# Altium project smartknob_v2.PrjPcb
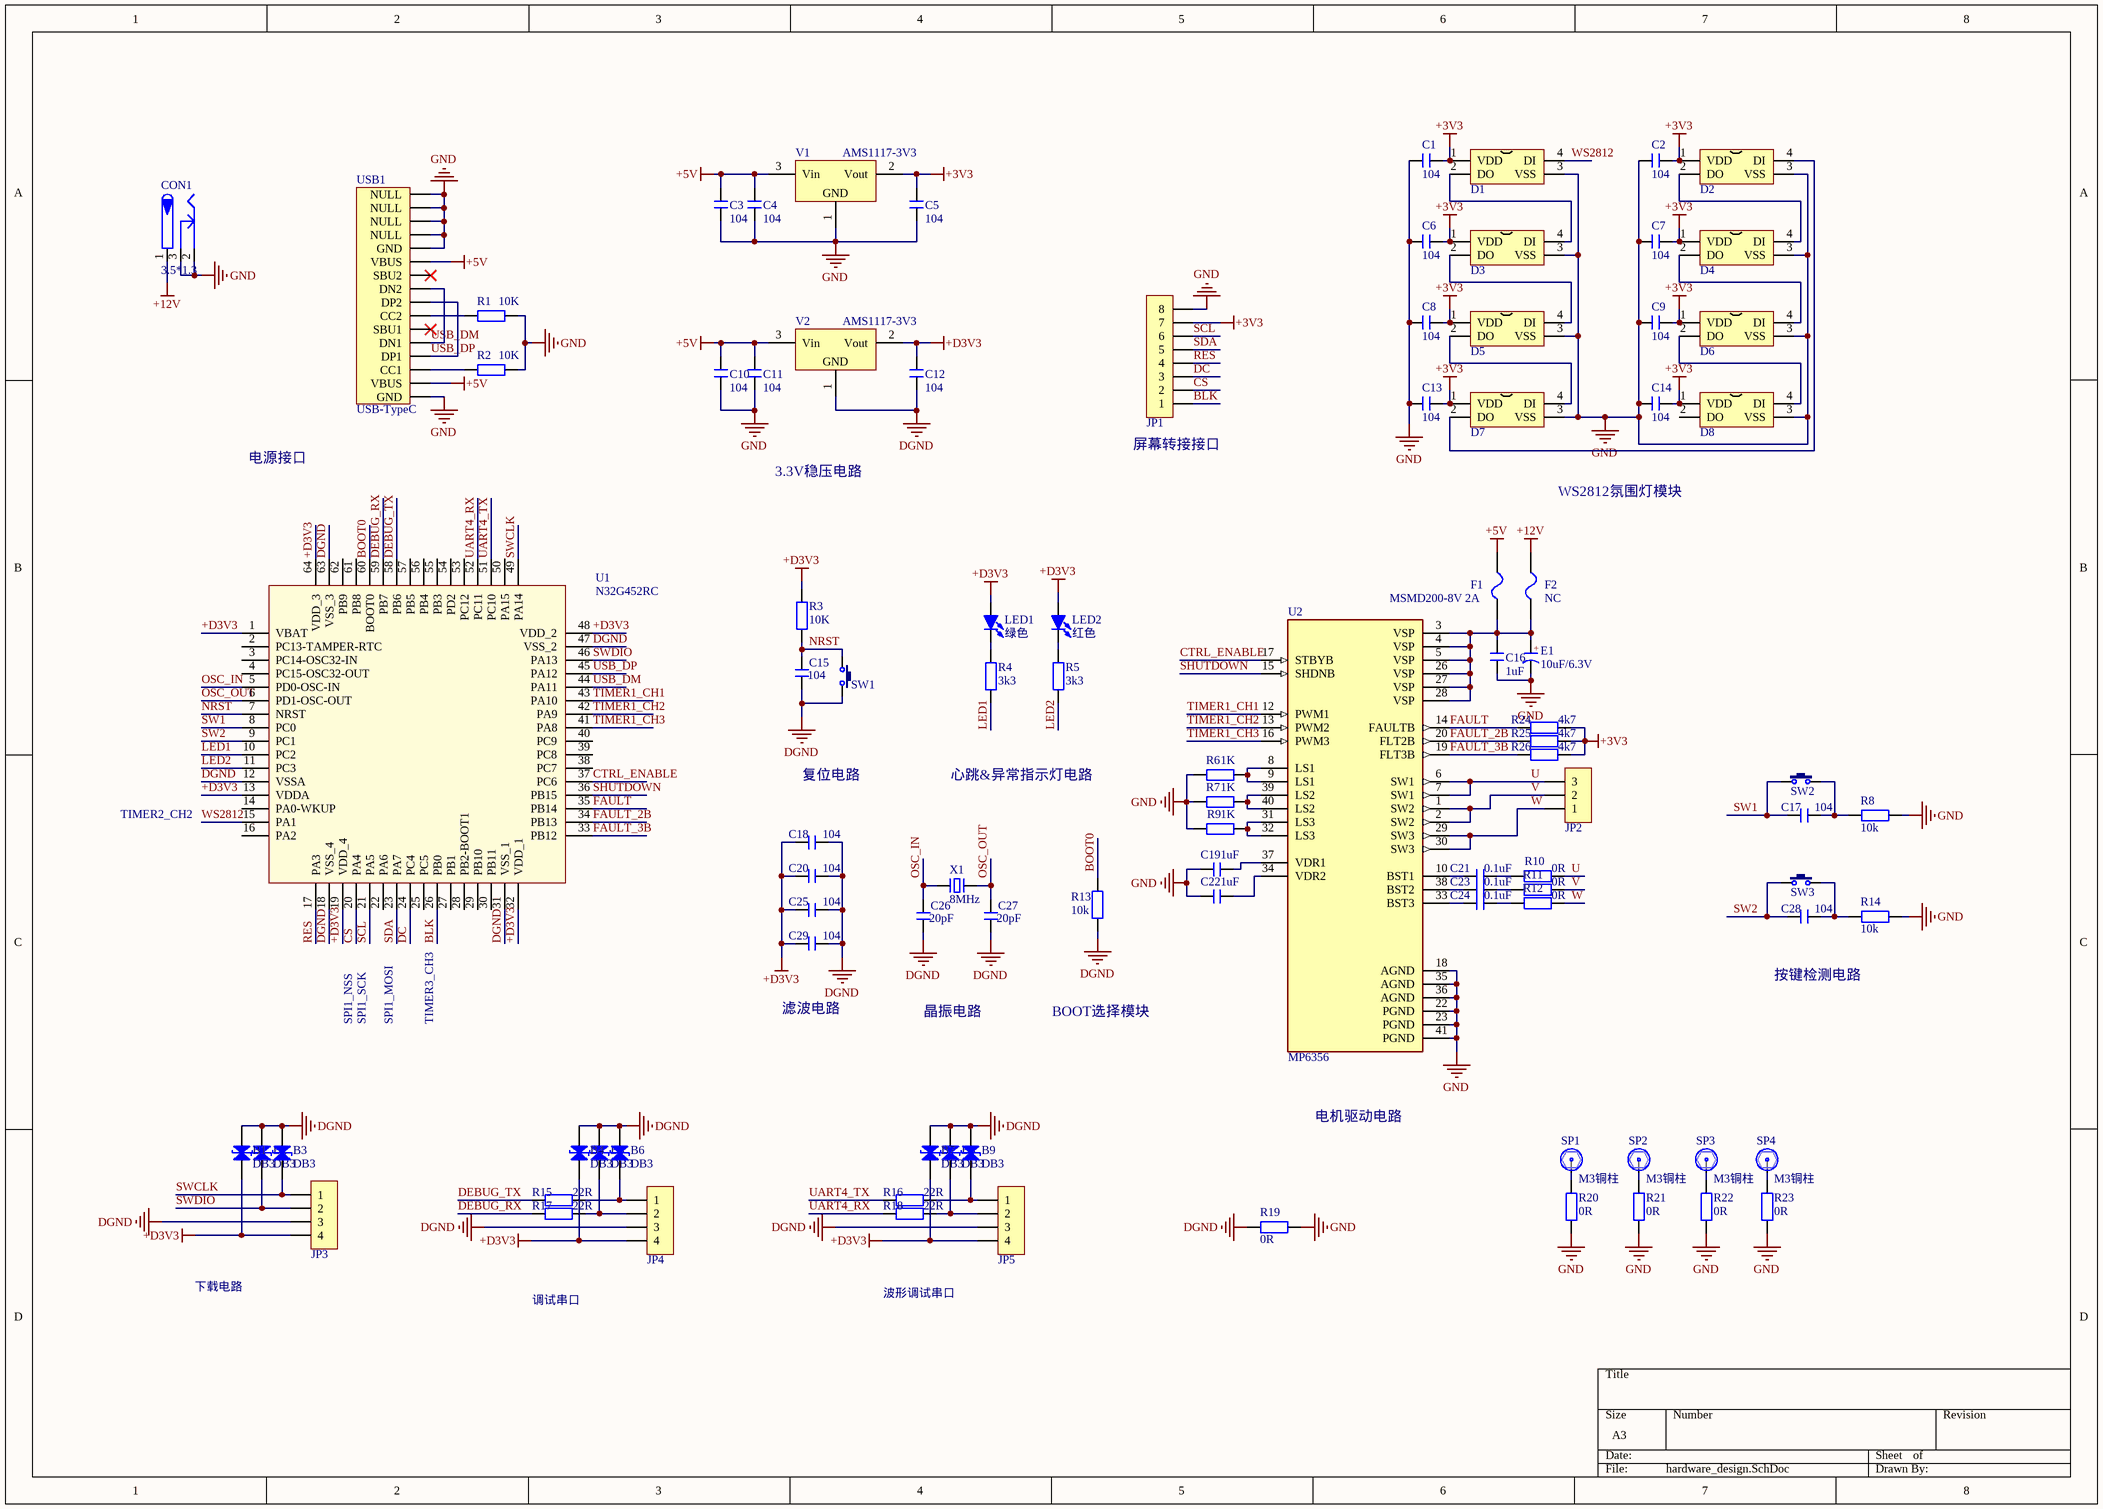
[diagram p0: hardware_design.SchDoc]
1 sheet, 96 parts. Net scope: global (net labels, ports and power ports of the same name join across sheets).
Board file: hardware_design.PcbDoc

## Sheet hardware_design.SchDoc
size A3

### Parts
B1  DB3  [SOD-323]
B2  DB3  [SOD-323]
B3  DB3  [SOD-323]
B4  DB3  [SOD-323]
B5  DB3  [SOD-323]
B6  DB3  [SOD-323]
B7  DB3  [SOD-323]
B8  DB3  [SOD-323]
B9  DB3  [SOD-323]
C1  104  [C 0603_M]
C2  104  [C 0603_M]
C3  104  [C 0603_M]
C4  104  [C 0603_M]
C5  104  [C 0603_M]
C6  104  [C 0603_M]
C7  104  [C 0603_M]
C8  104  [C 0603_M]
C9  104  [C 0603_M]
C10  104  [C 0603_M]
C11  104  [C 0603_M]
C12  104  [C 0603_M]
C13  104  [C 0603_M]
C14  104  [C 0603_M]
C15  104  [C 0603_M]
C16  1uF  [C 0603_M]
C17  104  [C 0603_M]
C18  104  [C 0603_M]
C19  1uF  [C 0603_M]
C20  104  [C 0603_M]
C21  0.1uF  [C 0603_M]
C22  1uF  [C 0603_M]
C23  0.1uF  [C 0603_M]
C24  0.1uF  [C 0603_M]
C25  104  [C 0603_M]
C26  20pF  [C 0603_M]
C27  20pF  [C 0603_M]
C28  104  [C 0603_M]
C29  104  [C 0603_M]
CON1  3.5*1.3  [DC-005]
D1  WS2812B  [WS2812 5050]  (value not drawn)
D2  WS2812B  [WS2812 5050]  (value not drawn)
D3  WS2812B  [WS2812 5050]  (value not drawn)
D4  WS2812B  [WS2812 5050]  (value not drawn)
D5  WS2812B  [WS2812 5050]  (value not drawn)
D6  WS2812B  [WS2812 5050]  (value not drawn)
D7  WS2812B  [WS2812 5050]  (value not drawn)
D8  WS2812B  [WS2812 5050]  (value not drawn)
E1  10uF/6.3V  [CD A(3216)]
F1  MSMD200-8V 2A  [FU 1210]
F2  NC  [FU 1210]
JP1  HDR-1X8  [MX 1.25-WS-8P]  (value not drawn)
JP2  HDR-1X3  [XH2.54-WI-3P]  (value not drawn)
JP3  HDR-1X4  [MX 1.25-LS-4P]  (value not drawn)
JP4  HDR-1X4  [MX 1.25-LS-4P]  (value not drawn)
JP5  HDR-1X4  [MX 1.25-LS-4P]  (value not drawn)
LED1  绿色  [LED 0805W]
LED2  红色  [LED 0805W]
R1  10K  [R 0805_M]
R2  10K  [R 0805_M]
R3  10K  [R 0603_M]
R4  3k3  [R 0603_M]
R5  3k3  [R 0603_M]
R6  1K  [R 1210_M]
R7  1K  [R 1210_M]
R8  10k  [R 0603_M]
R9  1K  [R 1210_M]
R10  0R  [R 0603_M]
R11  0R  [R 0603_M]
R12  0R  [R 0603_M]
R13  10k  [R 0603_M]
R14  10k  [R 0603_M]
R15  22R  [R 0603_M]
R16  22R  [R 0603_M]
R17  22R  [R 0603_M]
R18  22R  [R 0603_M]
R19  0R  [R 0603_M]
R20  0R  [R 0603_M]
R21  0R  [R 0603_M]
R22  0R  [R 0603_M]
R23  0R  [R 0603_M]
R24  4k7  [R 0603_M]
R25  4k7  [R 0603_M]
R26  4k7  [R 0603_M]
SP1  M3铜柱  [M3x4_L]
SP2  M3铜柱  [M3x4_L]
SP3  M3铜柱  [M3x4_L]
SP4  M3铜柱  [M3x4_L]
SW1  3x6x5  [TSW SMD-3*6*2.5]  (value not drawn)
SW2  3x6x5  [TSW SMD-3*6*2.5]  (value not drawn)
SW3  3x6x5  [TSW SMD-3*6*2.5]  (value not drawn)
U1  N32G452RC  [LQFP64-10*10]
U2  MP6356  [QFN40（5x5mm）]
USB1  USB-TypeC  [USB-TypeC-16Pin]
V1  AMS1117-3V3  [SOT223_M]
V2  AMS1117-3V3  [SOT223_M]
X1  8MHz  [OSC HC-49SMD]

### Nets
+3V3: C1.1 C2.1 C5.1 C6.1 C7.1 C8.1 C9.1 C13.1 C14.1 D1.1(VDD) D2.1(VDD) D3.1(VDD) D4.1(VDD) D5.1(VDD) D6.1(VDD) D7.1(VDD) D8.1(VDD) JP1.7 R24.2 R25.2 R26.2 V1.2(Vout)
+5V: C3.1 C4.1 C10.1 C11.1 F1.1 USB1.A4B9(VBUS) USB1.B4A9(VBUS) V1.3(Vin) V2.3(Vin)
+12V: CON1.1 F2.2
+D3V3: B1.2(K) B4.2(K) B7.2(K) C12.1 C18.2 C20.2 C25.2 C29.2 JP3.4 JP4.4 JP5.4 LED1.1(A) LED2.1(A) R3.2 U1.1(VBAT) U1.13(VDDA) U1.19(VDD_4) U1.32(VDD_1) U1.48(VDD_2) U1.64(VDD_3) V2.2(Vout)
DGND: B1.1(A) B2.1(A) B3.1(A) B4.1(A) B5.1(A) B6.1(A) B7.1(A) B8.1(A) B9.1(A) C12.2 C15.1 C18.1 C20.1 C25.1 C26.1 C27.1 C29.1 JP3.3 JP4.3 JP5.3 R13.1 R19.1 SW1.2 U1.12(VSSA) U1.18(VSS_4) U1.31(VSS_1) U1.47(VSS_2) U1.63(VSS_3) V2.1(GND)
GND: C1.2 C2.2 C3.2 C4.2 C5.2 C6.2 C7.2 C8.2 C9.2 C10.2 C11.2 C13.2 C14.2 C16.2 C19.1 C22.1 CON1.2 CON1.3 D1.3(VSS) D2.3(VSS) D3.3(VSS) D4.3(VSS) D5.3(VSS) D6.3(VSS) D7.3(VSS) D8.3(VSS) E1.2(K) JP1.8 R1.2 R2.2 R6.1 R7.1 R8.1 R9.1 R14.1 R19.2 R20.2 R21.2 R22.2 R23.2 U2.18(AGND) U2.22(PGND) U2.23(PGND) U2.35(AGND) U2.36(AGND) U2.41(PGND) USB1.1(NULL) USB1.2(NULL) USB1.3(NULL) USB1.4(NULL) USB1.A1B12(GND) USB1.B1A12(GND) V1.1(GND)
BLK: JP1.1 U1.26(PB0)
BOOT0: R13.2 U1.60(BOOT0)
CS: JP1.2 U1.20(PA4)
CTRL_ENABLE: U1.37(PC6) U2.17(STBYB)
DC: JP1.3 U1.24(PC4)
DEBUG_RX: R17.1 U1.59(PB7)
DEBUG_TX: R15.1 U1.58(PB6)
FAULT: R24.1 U1.35(PB14) U2.14(FAULTB)
FAULT_2B: R25.1 U1.34(PB13) U2.20(FLT2B)
FAULT_3B: R26.1 U1.33(PB12) U2.19(FLT3B)
LED1: R4.1 U1.10(PC2)
LED2: R5.1 U1.11(PC3)
NRST: C15.2 R3.1 SW1.1 U1.7(NRST)
OSC_IN: C26.2 U1.5(PD0-OSC-IN) X1.1
OSC_OUT: C27.2 U1.6(PD1-OSC-OUT) X1.2
RES: JP1.4 U1.17(PA3)
SCL: JP1.6 U1.21(PA5)
SDA: JP1.5 U1.23(PA7)
SHUTDOWN: U1.36(PB15) U2.15(SHDNB)
SW1: C17.2 SW2.1 U1.8(PC0)
SW2: C28.2 SW3.1 U1.9(PC1)
SWCLK: B3.2(K) JP3.1 U1.49(PA14)
SWDIO: B2.2(K) JP3.2 U1.46(PA13)
TIMER1_CH1: U1.43(PA10) U2.12(PWM1)
TIMER1_CH2: U1.42(PA9) U2.13(PWM2)
TIMER1_CH3: U1.41(PA8) U2.16(PWM3)
U: JP2.3 R10.2 U2.6(SW1) U2.7(SW1)
UART4_RX: R18.1 U1.52(PC11)
UART4_TX: R16.1 U1.51(PC10)
USB_DM: U1.44(PA11) USB1.A7(DN1) USB1.B7(DN2)
USB_DP: U1.45(PA12) USB1.A6(DP1) USB1.B6(DP2)
V: JP2.2 R11.2 U2.1(SW2) U2.2(SW2)
W: JP2.1 R12.2 U2.29(SW3) U2.30(SW3)
WS2812: D1.4(DI) U1.15(PA1)
NetB5_2: B5.2(K) JP4.2 R17.2
NetB6_2: B6.2(K) JP4.1 R15.2
NetB8_2: B8.2(K) JP5.2 R18.2
NetB9_2: B9.2(K) JP5.1 R16.2
NetC16_1: C16.1 E1.1(A) F1.2 F2.1 U2.3(VSP) U2.4(VSP) U2.5(VSP) U2.26(VSP) U2.27(VSP) U2.28(VSP)
NetC17_1: C17.1 R8.2 SW2.2
NetC19_2: C19.2 U2.37(VDR1)
NetC21_1: C21.1 U2.10(BST1)
NetC21_2: C21.2 R10.1
NetC22_2: C22.2 U2.34(VDR2)
NetC23_1: C23.1 U2.38(BST2)
NetC23_2: C23.2 R11.1
NetC24_1: C24.1 U2.33(BST3)
NetC24_2: C24.2 R12.1
NetC28_1: C28.1 R14.2 SW3.2
NetD1_2: D1.2(DO) D3.4(DI)
NetD2_2: D2.2(DO) D4.4(DI)
NetD2_4: D2.4(DI) D7.2(DO)
NetD3_2: D3.2(DO) D5.4(DI)
NetD4_2: D4.2(DO) D6.4(DI)
NetD5_2: D5.2(DO) D7.4(DI)
NetD6_2: D6.2(DO) D8.4(DI)
NetLED1_2: LED1.2(K) R4.2
NetLED2_2: LED2.2(K) R5.2
NetR1_1: R1.1 USB1.B5(CC2)
NetR2_1: R2.1 USB1.A5(CC1)
NetR6_2: R6.2 U2.8(LS1) U2.9(LS1)
NetR7_2: R7.2 U2.39(LS2) U2.40(LS2)
NetR9_2: R9.2 U2.31(LS3) U2.32(LS3)
NetR20_1: R20.1 SP1.1
NetR21_1: R21.1 SP2.1
NetR22_1: R22.1 SP3.1
NetR23_1: R23.1 SP4.1

Not connected (* = marked no-connect by the designer): D8 2(DO); U1 2(PC13-TAMPER-RTC) 3(PC14-OSC32-IN) 4(PC15-OSC32-OUT) 14(PA0-WKUP) 16(PA2) 22(PA6) 25(PC5) 27(PB1) 28(PB2-BOOT1) 29(PB10) 30(PB11) 38(PC7) 39(PC8) 40(PC9) 50(PA15) 53(PC12) 54(PD2) 55(PB3) 56(PB4) 57(PB5) 61(PB8) 62(PB9); USB1 A8(SBU1)* B8(SBU2)*

### Notes on the sheet
- (near JP1) 屏幕转接接口
- 电源接口
- 3.3V稳压电路
- WS2812氛围灯模块
- 复位电路
- 心跳&异常指示灯电路
- TIMER2_CH2
- 按键检测电路
- SPI1_NSS
- SPI1_SCK
- SPI1_MOSI
- TIMER3_CH3
- 滤波电路
- 晶振电路
- BOOT选择模块
- 电机驱动电路
- 下载电路
- 调试串口
- 波形调试串口
- (in symbol C-CD) +

### Library data of the parts
B1-B9 = DB3: 双向触发二极管
C1-C29 = C: 无极性贴片电容; 版权归属: 源创客; BOM名称: 无极性贴片电容; 学习资源: www.ooocke.com
CON1 = P-DC: 低压电源接口; BOM名称: DC电源接口; 版权归属: 源创客; 学习资源: www.ooocke.com
E1 = C-CD: 贴片钽电容; 版权归属: 源创客; BOM名称: 贴片钽电容; 学习资源: www.ooocke.com
F1 F2 = FU: 贴片保险丝; 版权归属: 源创客; BOM名称: 贴片保险丝; 学习资源: www.ooocke.com
JP1 = Header 8: 8P接插件; 版权归属: 源创客; BOM名称: 8P接插件; 学习资源: www.ooocke.com
JP2 = Header 3: 3P接插件; 版权归属: 源创客; BOM名称: 3P接插件; 学习资源: www.ooocke.com
JP3-JP5 = Header 4: 4P接插件; 版权归属: 源创客; BOM名称: 4P接插件; 学习资源: www.ooocke.com
LED1 LED2 = LED-SMD: 贴片LED; 版权归属: 源创客; BOM名称: 贴片LED; 学习资源: www.ooocke.com
R1-R26 = R: 贴片电阻; 版权归属: 源创客; BOM名称: 贴片电阻; 学习资源: www.ooocke.com
SP1-SP4 = 铜柱小焊盘: 铜柱; 版权归属: 源创客; BOM名称: 铜柱; 学习资源: www.ooocke.com
SW1-SW3 = TSW 3x6: 3x6轻触开关; 版权归属: 源创客; BOM名称: 3x6轻触开关; 学习资源: www.ooocke.com
U1 = N32G452RC: 国民技术32位mcu IO64
U2 = MP6536DU-LF-P: 直流无刷电机驱动IC
USB1 = USB-TypeC-16Pin: TypeC 16pin
V1 V2 = AMS1117: 三端稳压芯片; BOM名称: 稳压芯片; 版权归属: 源创客; 学习资源: www.ooocke.com
X1 = XTAL-2P: 2脚无源脚晶振; 版权归属: 源创客; BOM名称: 2脚无源脚晶振; 学习资源: www.ooocke.com